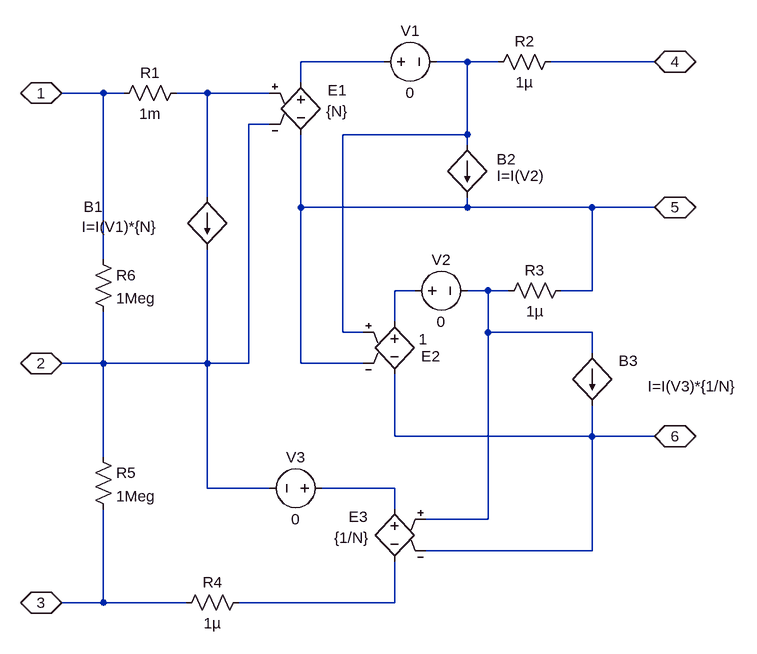
[diagram p0: schematic XFMR_CTap2.asc]
XFMR_CTap2.asc, the LTspice schematic file:
Version 4.1
SHEET 1 880 952
WIRE 336 48 208 48
WIRE 464 48 416 48
WIRE 512 48 464 48
WIRE 752 48 592 48
WIRE 208 80 208 48
WIRE -96 96 -160 96
WIRE -64 96 -96 96
WIRE 64 96 16 96
WIRE 160 96 64 96
WIRE 160 144 128 144
WIRE 464 160 464 48
WIRE 464 160 272 160
WIRE 464 176 464 160
WIRE 64 256 64 96
WIRE 208 272 208 160
WIRE 464 272 464 256
WIRE 464 272 208 272
WIRE 656 272 464 272
WIRE 752 272 656 272
WIRE -96 352 -96 96
WIRE 384 400 352 400
WIRE 496 400 464 400
WIRE 528 400 496 400
WIRE 656 400 656 272
WIRE 656 400 608 400
WIRE 352 448 352 400
WIRE 272 464 272 160
WIRE 304 464 272 464
WIRE 496 464 496 400
WIRE 656 464 496 464
WIRE 656 496 656 464
WIRE -96 512 -96 432
WIRE -96 512 -160 512
WIRE 64 512 64 336
WIRE 64 512 -96 512
WIRE 128 512 128 144
WIRE 128 512 64 512
WIRE 208 512 208 272
WIRE 304 512 208 512
WIRE 352 624 352 528
WIRE 656 624 656 576
WIRE 656 624 352 624
WIRE 752 624 656 624
WIRE -96 656 -96 512
WIRE 64 704 64 512
WIRE 160 704 64 704
WIRE 352 704 240 704
WIRE 352 736 352 704
WIRE 496 752 496 464
WIRE 496 752 400 752
WIRE 656 800 656 624
WIRE 656 800 400 800
WIRE -96 880 -96 736
WIRE -96 880 -160 880
WIRE 32 880 -96 880
WIRE 352 880 352 816
WIRE 352 880 112 880
FLAG -160 96 1
IOPIN -160 96 BiDir
FLAG -160 512 2
IOPIN -160 512 BiDir
FLAG 752 48 4
IOPIN 752 48 BiDir
FLAG 752 272 5
IOPIN 752 272 BiDir
FLAG 752 624 6
IOPIN 752 624 BiDir
FLAG -160 880 3
IOPIN -160 880 BiDir
SYMBOL res 32 80 R90
WINDOW 0 0 56 VBottom 2
WINDOW 3 32 56 VTop 2
SYMATTR InstName R1
SYMATTR Value 1m
SYMBOL e 208 64 R0
WINDOW 0 41 28 Left 2
WINDOW 3 39 60 Left 2
SYMATTR InstName E1
SYMATTR Value {N}
SYMBOL voltage 320 48 R270
WINDOW 0 32 56 VTop 2
WINDOW 3 -32 56 VBottom 2
SYMATTR InstName V1
SYMATTR Value 0
SYMBOL res 608 32 R90
WINDOW 0 0 56 VBottom 2
WINDOW 3 32 56 VTop 2
SYMATTR InstName R2
SYMATTR Value 1µ
SYMBOL bi 64 256 R0
WINDOW 0 -190 15 Left 2
WINDOW 3 -193 46 Left 2
SYMATTR InstName B1
SYMATTR Value I=I(V1)*{N}
SYMBOL e 352 432 R0
WINDOW 0 41 69 Left 2
WINDOW 3 37 43 Left 2
SYMATTR InstName E2
SYMATTR Value 1
SYMBOL voltage 368 400 R270
WINDOW 0 32 56 VTop 2
WINDOW 3 -32 56 VBottom 2
SYMATTR InstName V2
SYMATTR Value 0
SYMBOL res 624 384 R90
WINDOW 0 0 56 VBottom 2
WINDOW 3 32 56 VTop 2
SYMATTR InstName R3
SYMATTR Value 1µ
SYMBOL bi 464 176 R0
WINDOW 0 45 22 Left 2
WINDOW 3 45 47 Left 2
SYMATTR InstName B2
SYMATTR Value I=I(V2)
SYMBOL e 352 720 M0
WINDOW 0 41 28 Left 2
WINDOW 3 39 60 Left 2
SYMATTR InstName E3
SYMATTR Value {1/N}
SYMBOL voltage 256 704 R90
WINDOW 0 -32 56 VBottom 2
WINDOW 3 32 56 VTop 2
SYMATTR InstName V3
SYMATTR Value 0
SYMBOL res 128 864 R90
WINDOW 0 0 56 VBottom 2
WINDOW 3 32 56 VTop 2
SYMATTR InstName R4
SYMATTR Value 1µ
SYMBOL bi 656 496 M0
WINDOW 0 -70 12 Left 2
WINDOW 3 -222 51 Left 2
SYMATTR InstName B3
SYMATTR Value I=I(V3)*{1/N}
SYMBOL res -112 640 R0
SYMATTR InstName R5
SYMATTR Value 1Meg
SYMBOL res -112 336 R0
SYMATTR InstName R6
SYMATTR Value 1Meg

The netlist it stands for:
* XFMR_CTap2.asc
R1 N003 1 1m
E1 N001 5 N003 2 {N}
V1 N001 N002 0
R2 4 N002 1µ
B1 N003 2 I=I(V1)*{N}
E2 N004 6 N002 5 1
V2 N004 N005 0
R3 5 N005 1µ
B2 N002 5 I=I(V2)
E3 N006 N007 N005 6 {1/N}
V3 N006 2 0
R4 N007 3 1µ
B3 N005 6 I=I(V3)*{1/N}
R5 2 3 1Meg
R6 1 2 1Meg
.backanno
.end